# EAGLE schematic ed_esquema (EAGLE 7.2.0)
CDESIGNER: Apellido, Nombre; CNAME: ENTRENADORA DIGITAL; CREVISION: 1.0; CSCHO: ESCUELA
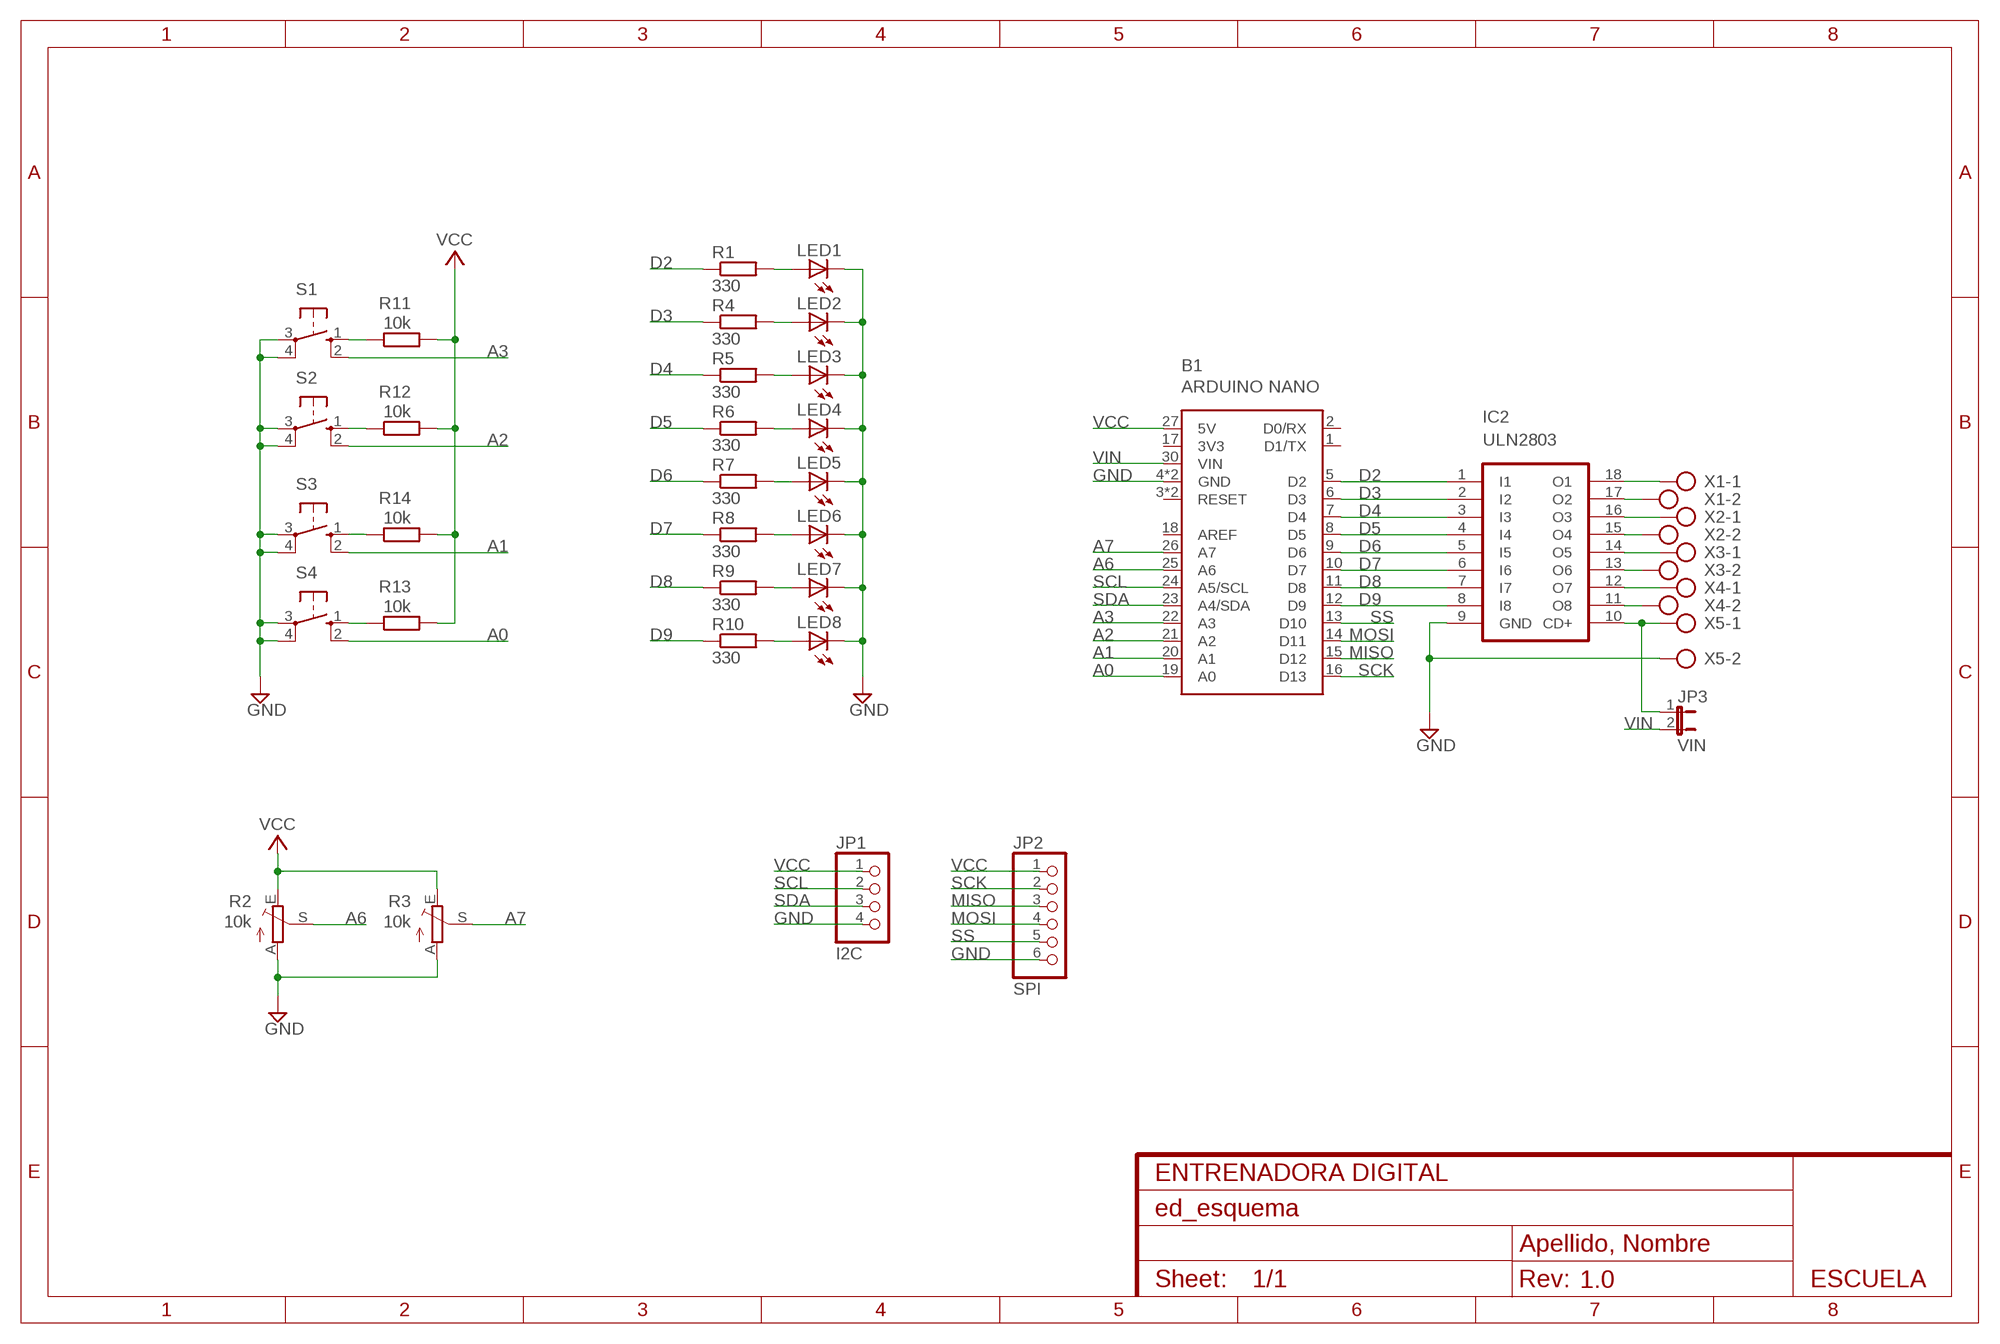
[diagram p0: schematic, sheet 1]

## Parts
B1  ARDUINO NANO  ARDUINO_NANO  [NANO]
IC2  ULN2803  ULN2803A  [DIL18]
JP1  I2C  PINHD-1X4  [1X04]
JP2  SPI  PINHD-1X6  [1X06]
JP3  VIN  JP1E  [JP1]
LED1  LED3MM  [LED_3MM]
LED2  LED3MM  [LED_3MM]
LED3  LED3MM  [LED_3MM]
LED4  LED3MM  [LED_3MM]
LED5  LED3MM  [LED_3MM]
LED6  LED3MM  [LED_3MM]
LED7  LED3MM  [LED_3MM]
LED8  LED3MM  [LED_3MM]
R1  330  RESISTOR-EU0204/7  [0204/7]
R2  10k  TRIM_EU-B64W  [B64W]
R3  10k  TRIM_EU-B64W  [B64W]
R4  330  RESISTOR-EU0204/7  [0204/7]
R5  330  RESISTOR-EU0204/7  [0204/7]
R6  330  RESISTOR-EU0204/7  [0204/7]
R7  330  RESISTOR-EU0204/7  [0204/7]
R8  330  RESISTOR-EU0204/7  [0204/7]
R9  330  RESISTOR-EU0204/7  [0204/7]
R10  330  RESISTOR-EU0204/7  [0204/7]
R11  10k  RESISTOR-EU0204/7  [0204/7]
R12  10k  RESISTOR-EU0204/7  [0204/7]
R13  10k  RESISTOR-EU0204/7  [0204/7]
R14  10k  RESISTOR-EU0204/7  [0204/7]
S1  SWITCH  [B3F-10XX]
S2  SWITCH  [B3F-10XX]
S3  SWITCH  [B3F-10XX]
S4  SWITCH  [B3F-10XX]
X1  BORNERA_AK500/2  [AK500/2]
X2  BORNERA_AK500/2  [AK500/2]
X3  BORNERA_AK500/2  [AK500/2]
X4  BORNERA_AK500/2  [AK500/2]
X5  BORNERA_AK500/2  [AK500/2]

## Nets
A0: B1.19(A0) S4.2(S1)
A1: B1.20(A1) S3.2(S1)
A2: B1.21(A2) S2.2(S1)
A3: B1.22(A3) S1.2(S1)
A6: B1.25(A6) R2.S
A7: B1.26(A7) R3.S
D2: B1.5(D2) IC2.1(I1) R1.1
D3: B1.6(D3) IC2.2(I2) R4.1
D4: B1.7(D4) IC2.3(I3) R5.1
D5: B1.8(D5) IC2.4(I4) R6.1
D6: B1.9(D6) IC2.5(I5) R7.1
D7: B1.10(D7) IC2.6(I6) R8.1
D8: B1.11(D8) IC2.7(I7) R9.1
D9: B1.12(D9) IC2.8(I8) R10.1
GND: B1.4(GND) B1.29(GND) IC2.9(GND) JP1.4 JP2.6 LED1.K(C) LED2.K(C) LED3.K(C) LED4.K(C) LED5.K(C) LED6.K(C) LED7.K(C) LED8.K(C) R2.A R3.A S1.3(P) S1.4(P1) S2.3(P) S2.4(P1) S3.3(P) S3.4(P1) S4.3(P) S4.4(P1) X5.2
MISO: B1.15(D12) JP2.3
MOSI: B1.14(D11) JP2.4
N$1: R11.1 S1.1(S)
N$3: R12.1 S2.1(S)
N$5: R14.1 S3.1(S)
N$7: R13.1 S4.1(S)
N$11: LED8.A R10.2
N$12: LED1.A R1.2
N$13: LED2.A R4.2
N$14: LED3.A R5.2
N$15: LED4.A R6.2
N$16: LED5.A R7.2
N$17: LED6.A R8.2
N$18: LED7.A R9.2
N$24: IC2.18(O1) X1.1
N$25: IC2.17(O2) X1.2
N$26: IC2.16(O3) X2.1
N$27: IC2.15(O4) X2.2
N$28: IC2.14(O5) X3.1
N$29: IC2.13(O6) X3.2
N$30: IC2.12(O7) X4.1
N$31: IC2.11(O8) X4.2
N$32: IC2.10(CD+) JP3.1 X5.1
SCK: B1.16(D13) JP2.2
SCL: B1.24(A5/SCL) JP1.2
SDA: B1.23(A4/SDA) JP1.3
SS: B1.13(D10) JP2.5
VCC: B1.27(5V) JP1.1 JP2.1 R2.E R3.E R11.2 R12.2 R13.2 R14.2
VIN: B1.30(VIN) JP3.2
Unconnected: B1.1(D1/TX) B1.2(D0/RX) B1.3(RESET) B1.17(3V3) B1.18(AREF) B1.28(RESET)

## Library data of the parts
B1 = treser_lib:ARDUINO_NANO: Arduino Nano
IC2 = uln-udn:ULN2803A: DRIVER ARRAY
JP1 = pinhead:PINHD-1X4: PIN HEADER
JP2 = pinhead:PINHD-1X6: PIN HEADER
JP3 = jumper:JP1E: JUMPER
LED1-LED8 = treser_lib:LED: LEDs
R1 R4-R14 = treser_lib:RESISTOR-EU: Resistor Simbolo europeo.
R2 R3 = pot:TRIM_EU-: POTENTIOMETER
S1-S4 = treser_lib:SWITCH: Switch OMRON; MPN: B3F-1000; OC_FARNELL: 176432; OC_NEWARK: 36M3542
X1-X5 = treser_lib:BORNERA_AK500/2: Bornera de tornillo; OC_FARNELL: unknown; OC_NEWARK: unknown